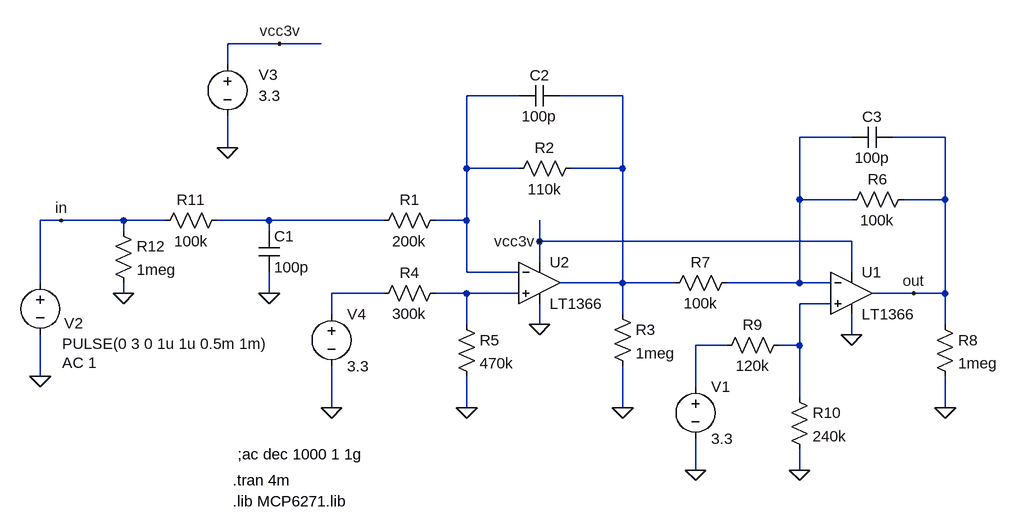
[diagram p0: schematic voltage_converter.asc]
voltage_converter.asc, the LTspice schematic file:
Version 4
SHEET 1 880 868
WIRE -1200 -112 -1280 -112
WIRE -1136 -112 -1200 -112
WIRE -1280 -80 -1280 -112
WIRE -832 -32 -912 -32
WIRE -672 -32 -768 -32
WIRE -320 32 -400 32
WIRE -176 32 -256 32
WIRE -1280 48 -1280 0
WIRE -912 80 -912 -32
WIRE -832 80 -912 80
WIRE -672 80 -672 -32
WIRE -672 80 -752 80
WIRE -400 128 -400 32
WIRE -320 128 -400 128
WIRE -176 128 -176 32
WIRE -176 128 -240 128
WIRE -1536 160 -1568 160
WIRE -1440 160 -1536 160
WIRE -1376 160 -1440 160
WIRE -1216 160 -1296 160
WIRE -1040 160 -1216 160
WIRE -912 160 -912 80
WIRE -912 160 -960 160
WIRE -1440 176 -1440 160
WIRE -1216 176 -1216 160
WIRE -800 192 -800 160
WIRE -320 192 -800 192
WIRE -800 224 -800 192
WIRE -912 240 -912 160
WIRE -832 240 -912 240
WIRE -320 240 -320 192
WIRE -1568 256 -1568 160
WIRE -672 256 -672 80
WIRE -672 256 -768 256
WIRE -592 256 -672 256
WIRE -400 256 -400 128
WIRE -400 256 -512 256
WIRE -352 256 -400 256
WIRE -1440 272 -1440 256
WIRE -1216 272 -1216 240
WIRE -1040 272 -1120 272
WIRE -912 272 -960 272
WIRE -832 272 -912 272
WIRE -224 272 -288 272
WIRE -176 272 -176 128
WIRE -176 272 -224 272
WIRE -352 288 -400 288
WIRE -1120 304 -1120 272
WIRE -672 304 -672 256
WIRE -912 320 -912 272
WIRE -800 320 -800 288
WIRE -176 320 -176 272
WIRE -320 336 -320 304
WIRE -512 352 -560 352
WIRE -400 352 -400 288
WIRE -400 352 -432 352
WIRE -1568 400 -1568 336
WIRE -560 416 -560 352
WIRE -400 432 -400 352
WIRE -1120 448 -1120 384
WIRE -912 448 -912 400
WIRE -672 448 -672 384
WIRE -176 448 -176 400
WIRE -560 544 -560 496
WIRE -400 544 -400 512
FLAG -1120 448 0
FLAG -800 320 0
FLAG -800 192 vcc3v
FLAG -672 448 0
FLAG -1568 400 0
FLAG -1280 48 0
FLAG -1200 -112 vcc3v
FLAG -1536 160 in
FLAG -912 448 0
FLAG -560 544 0
FLAG -320 336 0
FLAG -176 448 0
FLAG -400 544 0
FLAG -1216 272 0
FLAG -1440 272 0
FLAG -224 272 out
SYMBOL res -1056 176 R270
WINDOW 0 32 56 VTop 2
WINDOW 3 0 56 VBottom 2
SYMATTR InstName R1
SYMATTR Value 200k
SYMBOL res -848 96 R270
WINDOW 0 32 56 VTop 2
WINDOW 3 0 56 VBottom 2
SYMATTR InstName R2
SYMATTR Value 110k
SYMBOL res -688 288 R0
SYMATTR InstName R3
SYMATTR Value 1meg
SYMBOL voltage -1568 240 R0
WINDOW 123 34 139 Left 2
WINDOW 39 0 0 Left 2
WINDOW 0 37 78 Left 2
WINDOW 3 34 110 Left 2
SYMATTR Value2 AC 1
SYMATTR InstName V2
SYMATTR Value PULSE(0 3 0 1u 1u 0.5m 1m)
SYMBOL voltage -1280 -96 R0
WINDOW 123 24 124 Left 2
WINDOW 39 0 0 Left 2
WINDOW 0 48 32 Left 2
WINDOW 3 48 64 Left 2
SYMATTR InstName V3
SYMATTR Value 3.3
SYMBOL Opamps\\LT1366 -800 192 R0
SYMATTR InstName U2
SYMBOL voltage -1120 288 R0
WINDOW 123 0 0 Left 2
WINDOW 39 0 0 Left 2
SYMATTR InstName V4
SYMATTR Value 3.3
SYMBOL res -944 256 R90
WINDOW 0 0 56 VBottom 2
WINDOW 3 32 56 VTop 2
SYMATTR InstName R4
SYMATTR Value 300k
SYMBOL res -928 304 R0
SYMATTR InstName R5
SYMATTR Value 470k
SYMBOL Opamps\\LT1366 -320 208 R0
SYMATTR InstName U1
SYMBOL voltage -560 400 R0
WINDOW 123 0 0 Left 2
WINDOW 39 0 0 Left 2
SYMATTR InstName V1
SYMATTR Value 3.3
SYMBOL res -496 240 R90
WINDOW 0 0 56 VBottom 2
WINDOW 3 32 56 VTop 2
SYMATTR InstName R7
SYMATTR Value 100k
SYMBOL res -224 112 R90
WINDOW 0 0 56 VBottom 2
WINDOW 3 32 56 VTop 2
SYMATTR InstName R6
SYMATTR Value 100k
SYMBOL res -192 304 R0
SYMATTR InstName R8
SYMATTR Value 1meg
SYMBOL res -416 336 R90
WINDOW 0 0 56 VBottom 2
WINDOW 3 32 56 VTop 2
SYMATTR InstName R9
SYMATTR Value 120k
SYMBOL res -416 416 R0
SYMATTR InstName R10
SYMATTR Value 240k
SYMBOL res -1280 144 R90
WINDOW 0 0 56 VBottom 2
WINDOW 3 32 56 VTop 2
SYMATTR InstName R11
SYMATTR Value 100k
SYMBOL cap -1232 176 R0
SYMATTR InstName C1
SYMATTR Value 100p
SYMBOL res -1456 160 R0
SYMATTR InstName R12
SYMATTR Value 1meg
SYMBOL cap -768 -48 R90
WINDOW 0 0 32 VBottom 2
WINDOW 3 32 32 VTop 2
SYMATTR InstName C2
SYMATTR Value 100p
SYMBOL cap -256 16 R90
WINDOW 0 0 32 VBottom 2
WINDOW 3 32 32 VTop 2
SYMATTR InstName C3
SYMATTR Value 100p
TEXT -1272 560 Left 2 !.tran 4m
TEXT -1272 592 Left 2 !.lib MCP6271.lib
TEXT -1264 520 Left 2 !;ac dec 1000 1 1g

The netlist it stands for:
* voltage_converter.asc
R1 N004 N001 200k
R2 N001 N002 110k
R3 N002 0 1meg
V2 in 0 PULSE(0 3 0 1u 1u 0.5m 1m) AC 1
V3 vcc3v 0 3.3
XU2 N006 N001 vcc3v 0 N002 LT1366  ; pins In+ In- V+ V- OUT
V4 N005 0 3.3
R4 N006 N005 300k
R5 N006 0 470k
XU1 N007 N003 vcc3v 0 out LT1366  ; pins In+ In- V+ V- OUT
V1 N008 0 3.3
R7 N003 N002 100k
R6 out N003 100k
R8 out 0 1meg
R9 N007 N008 120k
R10 N007 0 240k
R11 N004 in 100k
C1 N004 0 100p
R12 in 0 1meg
C2 N002 N001 100p
C3 out N003 100p
.tran 4m
.lib MCP6271.lib
;ac dec 1000 1 1g
.lib LTC.lib
.backanno
.end